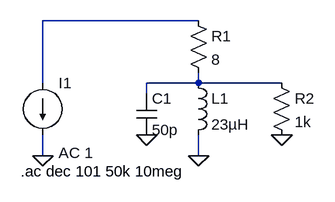
[diagram p0: schematic speaker_impedance.asc]
speaker_impedance.asc, the LTspice schematic file:
Version 4
SHEET 1 880 680
WIRE 320 32 80 32
WIRE 80 128 80 32
WIRE 320 128 320 112
WIRE 320 128 240 128
WIRE 448 128 320 128
WIRE 240 144 240 128
WIRE 80 240 80 208
WIRE 320 240 320 208
FLAG 320 240 0
FLAG 80 240 0
FLAG 240 208 0
FLAG 448 208 0
SYMBOL current 80 128 R0
WINDOW 123 24 108 Left 2
WINDOW 39 0 0 Left 0
SYMATTR InstName I1
SYMATTR Value ""
SYMATTR Value2 AC 1
SYMBOL res 304 16 R0
SYMATTR InstName R1
SYMATTR Value 8
SYMBOL ind 304 112 R0
SYMATTR InstName L1
SYMATTR Value 23µH
SYMBOL cap 224 144 R0
SYMATTR InstName C1
SYMATTR Value 50p
SYMBOL res 432 112 R0
SYMATTR InstName R2
SYMATTR Value 1k
TEXT 46 264 Left 2 !.ac dec 101 50k 10meg

The netlist it stands for:
* speaker_impedance.asc
I1 N001 0 AC 1
R1 N001 N002 8
L1 N002 0 23µH
C1 N002 0 50p
R2 N002 0 1k
.ac dec 101 50k 10meg
.backanno
.end